# EAGLE design motherboard_r2 (EAGLE 8.1.1)
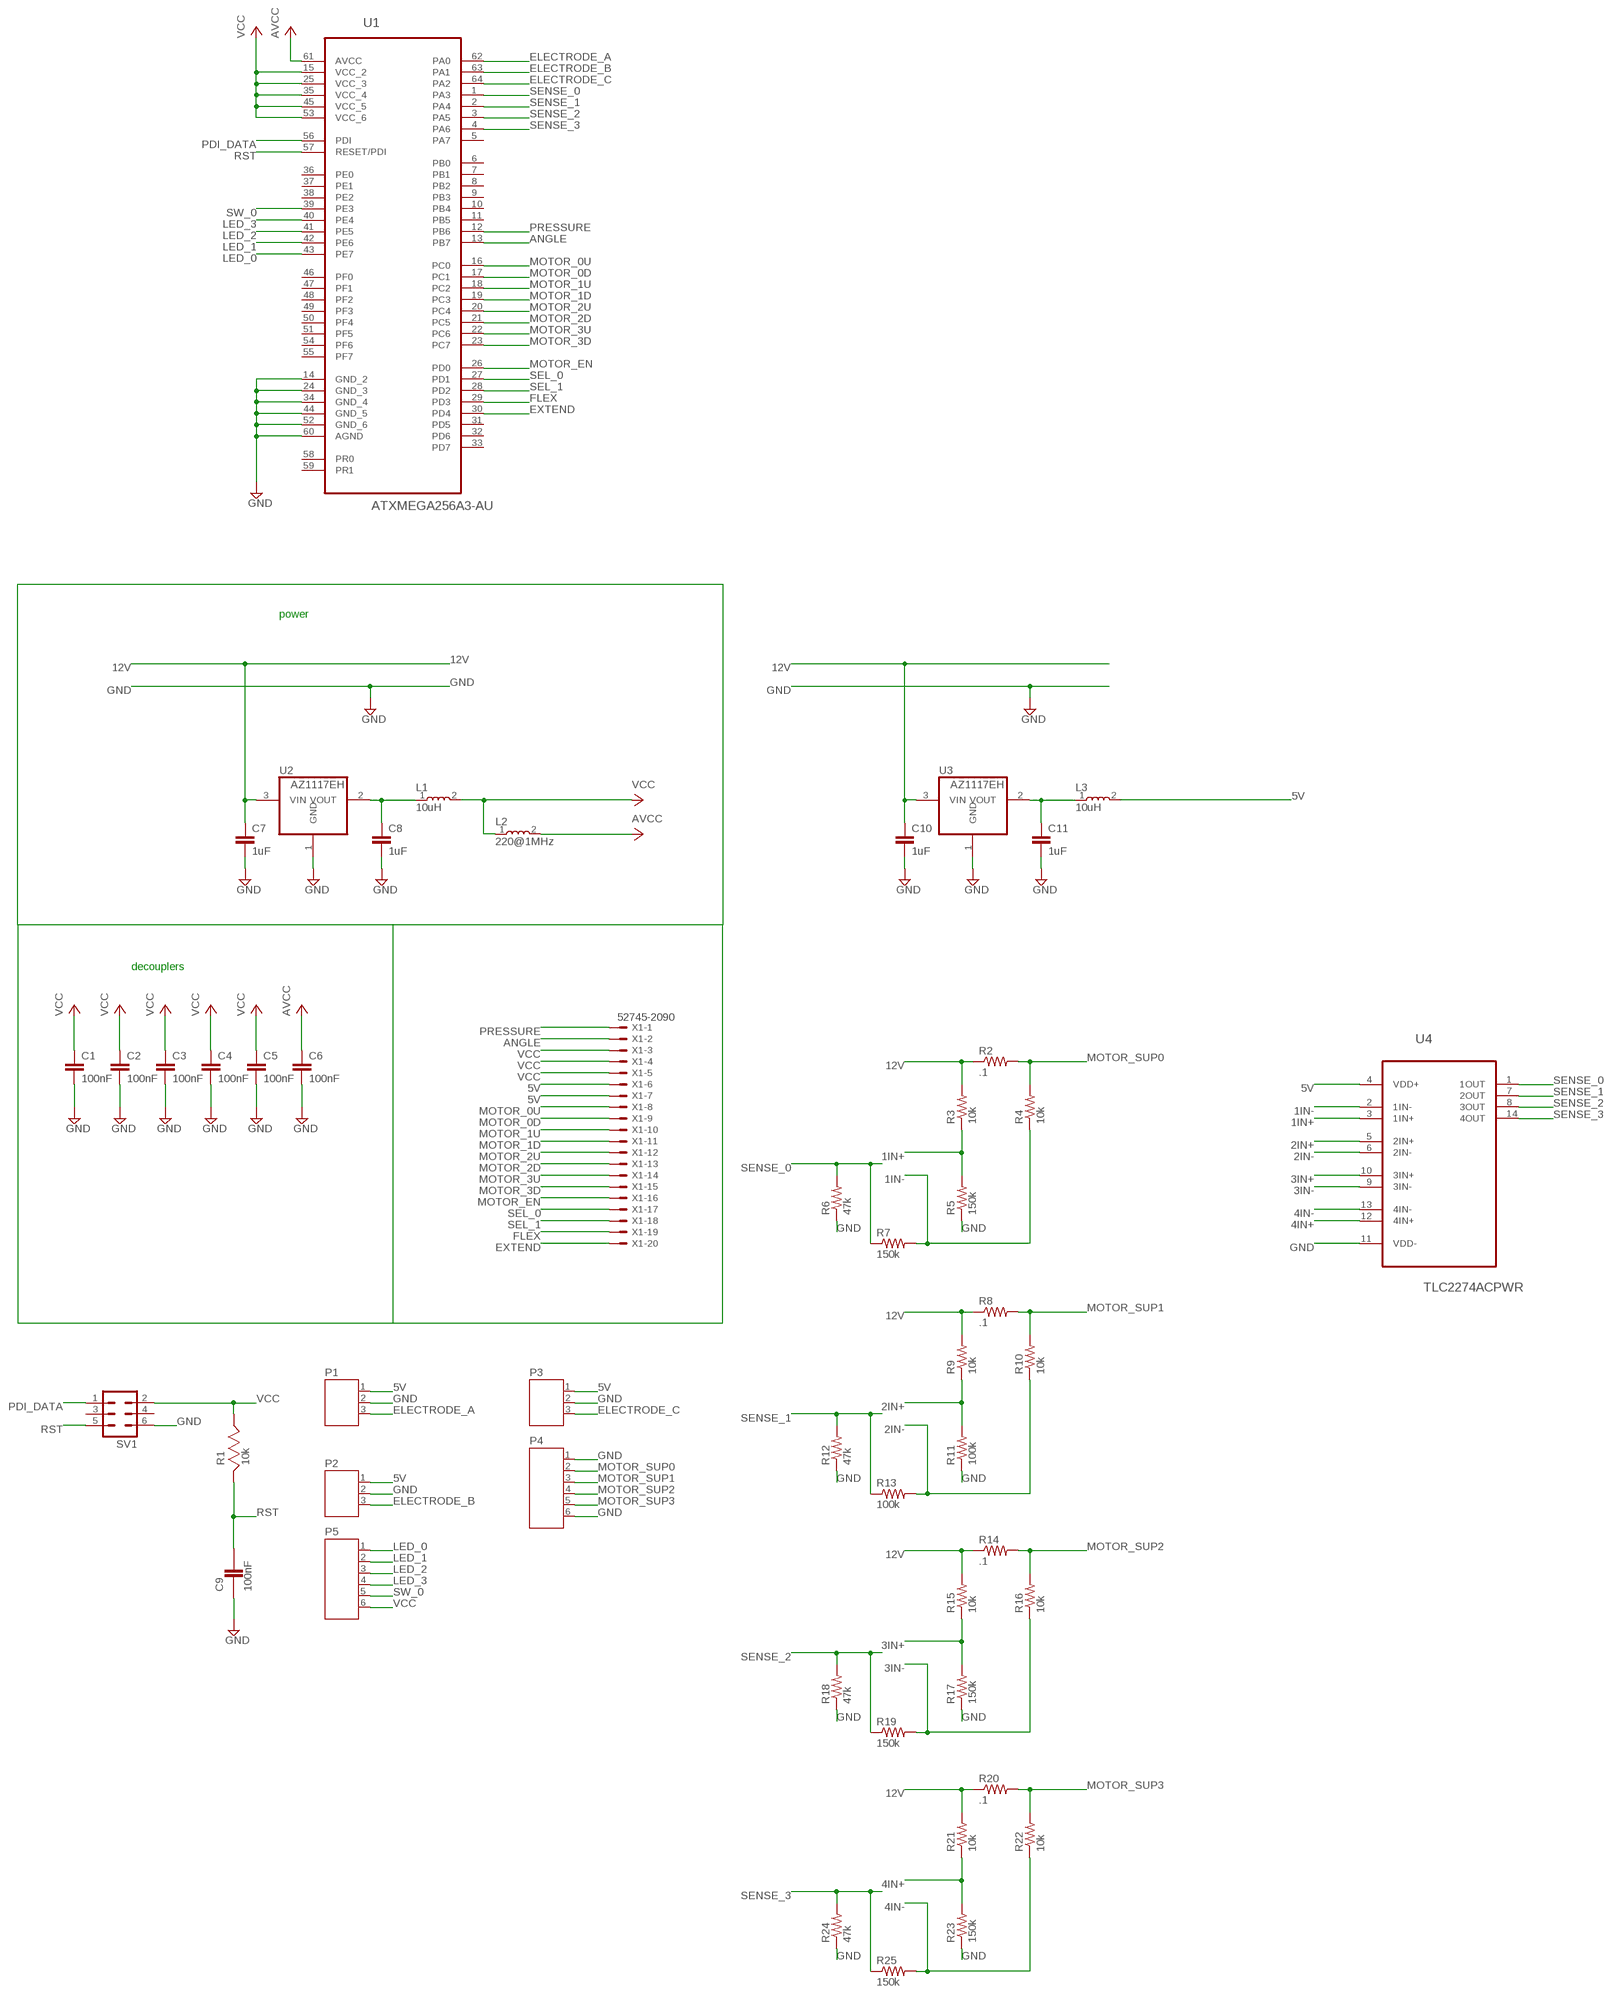
[diagram p0: schematic, sheet 1]

## Parts
C1  100nF  C-EUC0603  [C0603]
C2  100nF  C-EUC0603  [C0603]
C3  100nF  C-EUC0603  [C0603]
C4  100nF  C-EUC0603  [C0603]
C5  100nF  C-EUC0603  [C0603]
C6  100nF  C-EUC0603  [C0603]
C7  1uF  C-EUC0603  [C0603]
C8  1uF  C-EUC0603  [C0603]
C9  100nF  CC0603KRX7R8BB105  [CC0603KRX7R8BB105_CAPC1608X90]
C10  1uF  C-EUC0603  [C0603]
C11  1uF  C-EUC0603  [C0603]
L1  10uH  L0805  [0805]
L2  220@1MHz  L0805  [0805]
L3  10uH  L0805  [0805]
P1  JST-PH3  [JST-PH3]
P2  JST-PH3  [JST-PH3]
P3  JST-PH3  [JST-PH3]
P4  JST-PH6  [JST-PH6]
P5  JST-PH6  [JST-PH6]
R1  10k  CRCW060310K0FKEA  [CRCW060310K0FKEA_RESC1608X55]
R2  .1  R-US_R0603  [R0603]
R3  10k  R-US_R0603  [R0603]
R4  10k  R-US_R0603  [R0603]
R5  150k  R-US_R0603  [R0603]
R6  47k  R-US_R0603  [R0603]
R7  150k  R-US_R0603  [R0603]
R8  .1  R-US_R0603  [R0603]
R9  10k  R-US_R0603  [R0603]
R10  10k  R-US_R0603  [R0603]
R11  100k  R-US_R0603  [R0603]
R12  47k  R-US_R0603  [R0603]
R13  100k  R-US_R0603  [R0603]
R14  .1  R-US_R0603  [R0603]
R15  10k  R-US_R0603  [R0603]
R16  10k  R-US_R0603  [R0603]
R17  150k  R-US_R0603  [R0603]
R18  47k  R-US_R0603  [R0603]
R19  150k  R-US_R0603  [R0603]
R20  .1  R-US_R0603  [R0603]
R21  10k  R-US_R0603  [R0603]
R22  10k  R-US_R0603  [R0603]
R23  150k  R-US_R0603  [R0603]
R24  47k  R-US_R0603  [R0603]
R25  150k  R-US_R0603  [R0603]
SV1  MA03-2  [MA03-2]
U1  ATXMEGA256A3-AU  [QFP80P1600X1600X120-64N]
U2  AZ1117EH  [SOT230P700X160-4N]
U3  AZ1117EH  [SOT230P700X160-4N]
U4  TLC2274ACPWR  [SOP65P640X120-14N]
X1  52745-2090  [52745-2090]

## Nets
1IN+: R3.1 R5.2 U4.3(1IN+)
1IN-: R4.1 R7.2 U4.2(1IN-)
2IN+: R9.1 R11.2 U4.5(2IN+)
2IN-: R10.1 R13.2 U4.6(2IN-)
3IN+: R15.1 R17.2 U4.10(3IN+)
3IN-: R16.1 R19.2 U4.9(3IN-)
4IN+: R21.1 R23.2 U4.12(4IN+)
4IN-: R22.1 R25.2 U4.13(4IN-)
5V: L3.2 P1.1 P2.1 P3.1 U4.4(VDD+) X1.6 X1.7
12V: C7.1 C10.1 R2.1 R3.2 R8.1 R9.2 R14.1 R15.2 R20.1 R21.2 U2.3(VIN) U3.3(VIN)
ANGLE: U1.13(PB7) X1.2
AVCC: C6.1 L2.2 U1.61(AVCC)
ELECTRODE_A: P1.3 U1.62(PA0)
ELECTRODE_B: P2.3 U1.63(PA1)
ELECTRODE_C: P3.3 U1.64(PA2)
EXTEND: U1.30(PD4) X1.20
FLEX: U1.29(PD3) X1.19
GND: C1.2 C2.2 C3.2 C4.2 C5.2 C6.2 C7.2 C8.2 C9.1 C10.2 C11.2 P1.2 P2.2 P3.2 P4.1 P4.6 R5.1 R6.1 R11.1 R12.1 R17.1 R18.1 R23.1 R24.1 SV1.6 U1.14(GND_2) U1.24(GND_3) U1.34(GND_4) U1.44(GND_5) U1.52(GND_6) U1.60(AGND) U2.1(GND) U3.1(GND) U4.11(VDD-)
LED_0: P5.1 U1.43(PE7)
LED_1: P5.2 U1.42(PE6)
LED_2: P5.3 U1.41(PE5)
LED_3: P5.4 U1.40(PE4)
MOTOR_0D: U1.17(PC1) X1.9
MOTOR_0U: U1.16(PC0) X1.8
MOTOR_1D: U1.19(PC3) X1.11
MOTOR_1U: U1.18(PC2) X1.10
MOTOR_2D: U1.21(PC5) X1.13
MOTOR_2U: U1.20(PC4) X1.12
MOTOR_3D: U1.23(PC7) X1.15
MOTOR_3U: U1.22(PC6) X1.14
MOTOR_EN: U1.26(PD0) X1.16
MOTOR_SUP0: P4.2 R2.2 R4.2
MOTOR_SUP1: P4.3 R8.2 R10.2
MOTOR_SUP2: P4.4 R14.2 R16.2
MOTOR_SUP3: P4.5 R20.2 R22.2
N$1: C8.1 L1.1 U2.2(VOUT)
N$3: C11.1 L3.1 U3.2(VOUT)
PDI_DATA: SV1.1 U1.56(PDI)
PRESSURE: U1.12(PB6) X1.1
RST: C9.2 R1.1 SV1.5 U1.57(RESET/PDI)
SEL_0: U1.27(PD1) X1.17
SEL_1: U1.28(PD2) X1.18
SENSE_0: R6.2 R7.1 U1.1(PA3) U4.1(1OUT)
SENSE_1: R12.2 R13.1 U1.2(PA4) U4.7(2OUT)
SENSE_2: R18.2 R19.1 U1.3(PA5) U4.8(3OUT)
SENSE_3: R24.2 R25.1 U1.4(PA6) U4.14(4OUT)
SW_0: P5.5 U1.39(PE3)
VCC: C1.1 C2.1 C3.1 C4.1 C5.1 L1.2 L2.1 P5.6 R1.2 SV1.2 U1.15(VCC_2) U1.25(VCC_3) U1.35(VCC_4) U1.45(VCC_5) U1.53(VCC_6) X1.3 X1.4 X1.5
Unconnected: SV1.3 SV1.4 U1.5(PA7) U1.6(PB0) U1.7(PB1) U1.8(PB2) U1.9(PB3) U1.10(PB4) U1.11(PB5) U1.31(PD5) U1.32(PD6) U1.33(PD7) U1.36(PE0) U1.37(PE1) U1.38(PE2) U1.46(PF0) U1.47(PF1) U1.48(PF2) U1.49(PF3) U1.50(PF4) U1.51(PF5) U1.54(PF6) U1.55(PF7) U1.58(PR0) U1.59(PR1)

## Notes on the sheet
- power
- decouplers

## Library data of the parts
C1-C8 C10 C11 = rcl:C-EU: CAPACITOR, European symbol
C9 = Common-Parts-Library-Eagle:CC0603KRX7R8BB105: Cap Ceramic 1uF 25V X7R 10% SMD 0603 125C Paper T/R; MANUFACTURER: YAGEO
L1-L3 = hands:L0805
P1-P3 = jst-ph:JST-PH3
P4 P5 = jst-ph:JST-PH6
R1 = Common-Parts-Library-Eagle:CRCW060310K0FKEA: Res Thick Film 0603 10K Ohm 1% 0.1W(1/10W) ?100ppm/C Molded SMD Automotive Paper T/R; MANUFACTURER: VISHAY
R2-R25 = rcl:R-US_: RESISTOR, American symbol
SV1 = con-lstb:MA03-2: PIN HEADER; OC_FARNELL: unknown; OC_NEWARK: unknown
U1 = ATXMEGA256A3-AU:ATXMEGA256A3-AU: MCU; AVAILABILITY: Good; DESCRIPTION: XMEGA Series 32 MHz 256 KB Flash 16 KB SRAM 8/16-Bit Microcontroller - TQFP-64; MF: Atmel; MP: ATXMEGA256A3-AU; PACKAGE: TQFP-64 Atmel; PRICE: 8.74 USD
U2 U3 = hands:AZ1117EH
U4 = TLC2274ACPWR:TLC2274ACPWR: OPERATIONAL AMPLIFIERS; AVAILABILITY: Good; DESCRIPTION: Advanced LinCMOS%28TM%29 Rail-To-Rail Quad Operational Amplifier 14-TSSOP 0 to 70; MF: Texas Instruments; MP: TLC2274ACPWR; PACKAGE: TSSOP-14 Texas Instruments; PRICE: 1.29 USD
X1 = con-molex:52745-2090: FFC/FPC-to-Board 0.50mm (.020") SMT Top Contact Right Angle, ZIF, Style Receptacle 52745 / 52435 Source: http://www.molex.com/product/ffc/52745.html; MF: WALDOM/MOLEX; MPN: 52745-2090; OC_FARNELL: unknown; OC_NEWARK: 38C9891

## Board
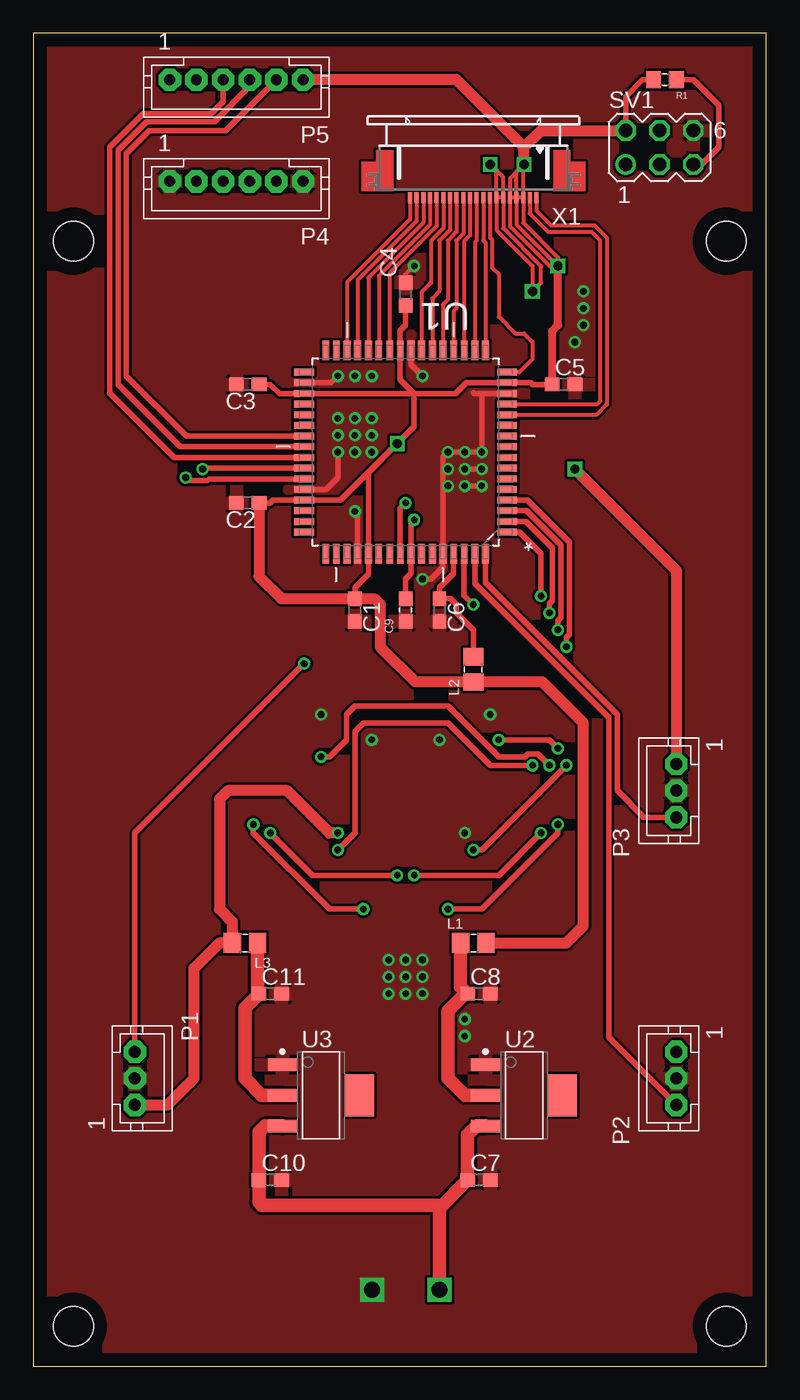
[diagram p1: board, top side]
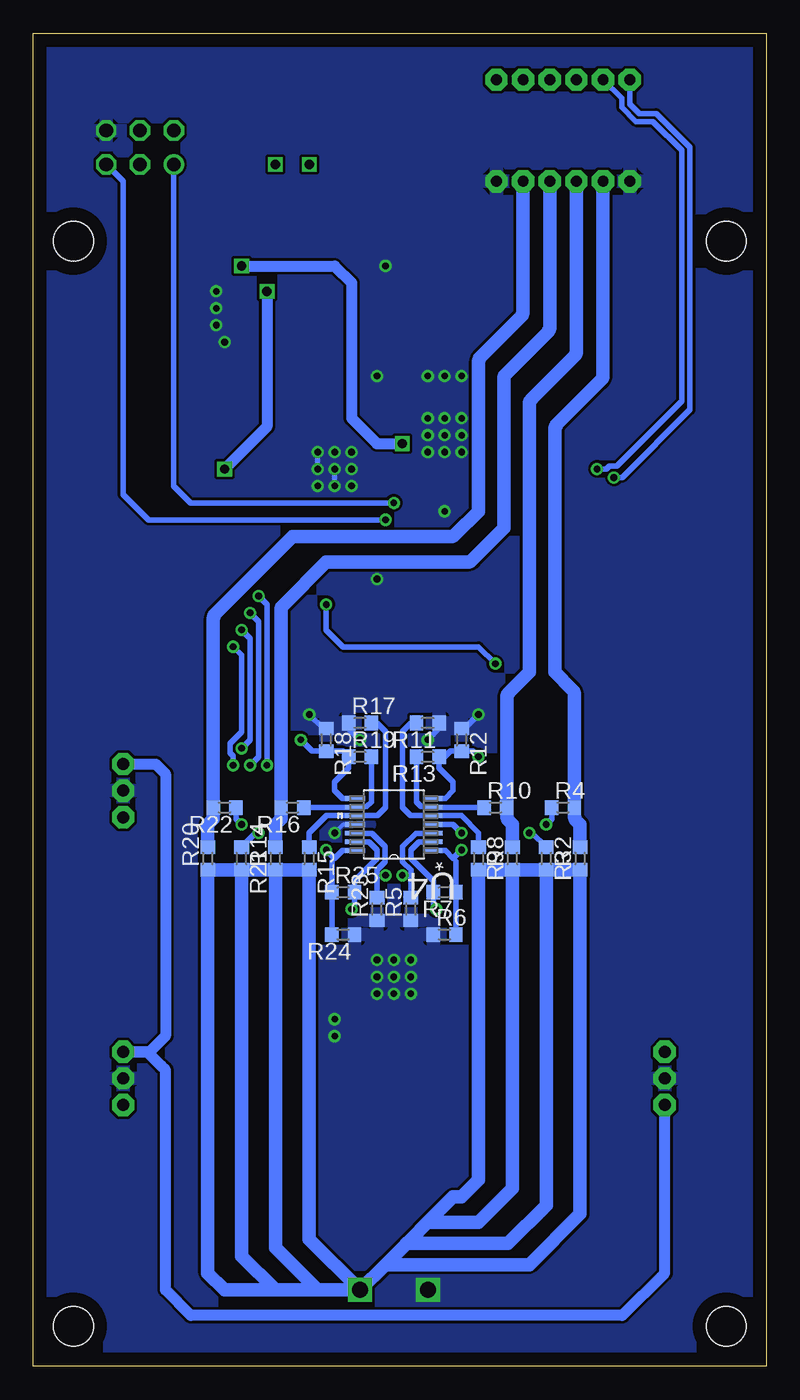
[diagram p2: board, bottom side, seen from below]

Size 55 x 100 mm. Coordinates in mm from the lower left corner, seen from the top.
Outline: 0,0 55,0 55,100 0,100 0,0
Copper layers (1*16): Top 0.035mm / dielectric 1.5mm / Bottom 0.035mm
Design rules "default": minimum track width 10mil, minimum drill 24mil, track to track 8mil, track to pad 8mil, pad to pad 8mil, via to via 8mil, smd to smd 8mil, copper to edge 40mil, drill to drill 8mil, minimum pad ring 10mil, minimum via ring 8mil, stop-mask expansion 4mil, vias tented up to drill 0mil, thermal gap 10mil
Holes 3 mm at 3,3 52,3 3,84.4 52,84.4

### Footprints (pad centres in the part's own frame; a part is rotated, then mirrored left to right if it is on the bottom)
C0603 = smd 1.1 x 1: 1 -0.85,0; 2 0.85,0
CC0603KRX7R8BB105_CAPC1608X90 = smd 1.1 x 1: 1 -0.85,0; 2 0.85,0
0805 = smd 1.3 x 1.5: 1 -0.95,0; 2 0.95,0
JST-PH3 = drill 0.9 pad 1.676 octagon: 1 2,0; 2 0,0; 3 -2,0
JST-PH6 = drill 0.813 pad 1.676 octagon: 1 5,0; 2 3,0; 3 1,0; 4 -1,0; 5 -3,0; 6 -5,0
CRCW060310K0FKEA_RESC1608X55 = smd 1.1 x 1.25: 1 -0.85,0; 2 0.85,0
R0603 = smd 1 x 1.1: 1 -0.85,0; 2 0.85,0
MA03-2 = drill 1.016: 1 -2.54,-1.27 | drill 1.016 octagon: 2 -2.54,1.27; 3 0,-1.27; 4 0,1.27; 5 2.54,-1.27; 6 2.54,1.27
QFP80P1600X1600X120-64N = smd 1.473 x 0.508: 1 -7.62,5.994; 2 -7.62,5.207; 3 -7.62,4.394; 4 -7.62,3.607; 5 -7.62,2.794; 6 -7.62,2.007; 7 -7.62,1.194; 8 -7.62,0.406; 9 -7.62,-0.406; 10 -7.62,-1.194; 11 -7.62,-2.007; 12 -7.62,-2.794; 13 -7.62,-3.607; 14 -7.62,-4.394; 15 -7.62,-5.207; 16 -7.62,-5.994; 33 7.62,-5.994; 34 7.62,-5.207; 35 7.62,-4.394; 36 7.62,-3.607; 37 7.62,-2.794; 38 7.62,-2.007; 39 7.62,-1.194; 40 7.62,-0.406; 41 7.62,0.406; 42 7.62,1.194; 43 7.62,2.007; 44 7.62,2.794; 45 7.62,3.607; 46 7.62,4.394; 47 7.62,5.207; 48 7.62,5.994 | smd 0.508 x 1.473: 17 -5.994,-7.62; 18 -5.207,-7.62; 19 -4.394,-7.62; 20 -3.607,-7.62; 21 -2.794,-7.62; 22 -2.007,-7.62; 23 -1.194,-7.62; 24 -0.406,-7.62; 25 0.406,-7.62; 26 1.194,-7.62; 27 2.007,-7.62; 28 2.794,-7.62; 29 3.607,-7.62; 30 4.394,-7.62; 31 5.207,-7.62; 32 5.994,-7.62; 49 5.994,7.62; 50 5.207,7.62; 51 4.394,7.62; 52 3.607,7.62; 53 2.794,7.62; 54 2.007,7.62; 55 1.194,7.62; 56 0.406,7.62; 57 -0.406,7.62; 58 -1.194,7.62; 59 -2.007,7.62; 60 -2.794,7.62; 61 -3.607,7.62; 62 -4.394,7.62; 63 -5.207,7.62; 64 -5.994,7.62
SOT230P700X160-4N = smd 2.15 x 0.95: 1 -2.9,2.3; 2 -2.9,0; 3 -2.9,-2.3 | smd 2.15 x 3.15: 4 2.9,0
SOP65P640X120-14N = smd 1.473 x 0.356: 1 -2.921,1.956; 2 -2.921,1.295; 3 -2.921,0.66; 4 -2.921,0; 5 -2.921,-0.66; 6 -2.921,-1.295; 7 -2.921,-1.956; 8 2.921,-1.956; 9 2.921,-1.295; 10 2.921,-0.66; 11 2.921,0; 12 2.921,0.66; 13 2.921,1.295; 14 2.921,1.956
52745-2090 = smd 0.3 x 0.8: 1 -4.75,2.5; 2 -4.25,2.5; 3 -3.75,2.5; 4 -3.25,2.5; 5 -2.75,2.5; 6 -2.25,2.5; 7 -1.75,2.5; 8 -1.25,2.5; 9 -0.75,2.5; 10 -0.25,2.5; 11 0.25,2.5; 12 0.75,2.5; 13 1.25,2.5; 14 1.75,2.5; 15 2.25,2.5; 16 2.75,2.5; 17 3.25,2.5; 18 3.75,2.5; 19 4.25,2.5; 20 4.75,2.5

### Placement (x,y rotation side)
C1  24.13,56.73 270 top
C2  16.09,64.77 180 top
C3  16.09,73.66 180 top
C4  27.94,80.43 90 top
C5  39.79,73.66 0 top
C6  30.48,56.73 270 top
C7  33.44,13.97 0 top
C8  33.44,27.94 0 top
C9  27.94,56.73 90 top
C10  17.78,13.97 0 top
C11  17.78,27.94 0 top
L1  33.02,31.75 0 top
L2  33.02,52.28 90 top
L3  15.88,31.75 180 top
P1  7.62,21.59 270 top
P2  48.26,21.59 90 top
P3  48.26,43.18 90 top
P4  15.24,88.9 180 top
P5  15.24,96.52 180 top
R1  47.41,96.52 180 top
R2  13.97,38.1 90 bottom
R3  16.51,38.1 270 bottom
R4  15.24,41.91 0 bottom
R5  26.67,34.29 90 bottom
R6  24.13,32.38 0 bottom
R7  24.13,35.56 180 bottom
R8  19.05,38.1 90 bottom
R9  21.59,38.1 270 bottom
R10  20.32,41.91 0 bottom
R11  25.4,48.26 180 bottom
R12  22.86,46.99 270 bottom
R13  25.4,45.72 180 bottom
R14  36.83,38.1 90 bottom
R15  34.29,38.1 270 bottom
R16  35.56,41.91 180 bottom
R17  30.48,48.26 0 bottom
R18  33.02,46.99 270 bottom
R19  30.48,45.72 0 bottom
R20  41.91,38.1 90 bottom
R21  39.37,38.1 270 bottom
R22  40.64,41.91 180 bottom
R23  29.21,34.29 90 bottom
R24  31.75,32.38 180 bottom
R25  31.75,35.56 0 bottom
SV1  46.99,91.44 0 top
U1  27.94,68.58 180 top
U2  36.83,20.32 0 top
U3  21.59,20.32 0 top
U4  27.94,40.64 180 bottom
X1  33.02,90.17 180 top

### Tracks (layer width: path | path; a pad name or v marks a point on that pad's centre or on a via)
1IN+  (via drill 0.5)
  Top 0.406: v17.78,40.01 20.95,36.83 v27.3,36.83
  Bottom 0.406: 26.67,36.83 26.67,37.24 27.28,37.85 27.28,38.99 26.29,39.98 U4.3 | 26.67,36.83 R5.2 | R3.1 17.57,40.01 v17.78,40.01 | v27.3,36.83 26.67,36.83
1IN-  (via drill 0.5)
  Top 0.406: v16.51,40.64 16.51,40.01 22.23,34.29 v24.77,34.29
  Bottom 0.406: U4.2 26.06,39.34 26.67,38.73 26.67,38.1 24.98,36.41 R7.2 24.98,34.51 v24.77,34.29 | R4.1 16.09,41.06 v16.51,40.64
2IN+
  Bottom 0.406: R9.1 21.59,40.01 22.89,41.3 U4.5 26.7,41.3 27.3,41.91 27.3,47.62 26.67,48.26 R11.2
2IN-
  Bottom 0.406: R10.1 21.17,41.94 U4.6 25.07,41.99 25.9,41.99 26.25,42.34 R13.2
3IN+
  Bottom 0.406: R15.1 34.29,40.01 32.99,41.3 U4.10 29.18,41.3 28.57,41.91 28.57,47.62 29.21,48.26 R17.2
3IN-
  Bottom 0.406: R19.2 29.63,42.34 29.98,41.99 30.81,41.99 U4.9 30.89,41.91 R16.1
4IN+  (via drill 0.5)
  Top 0.406: v38.1,40.01 34.92,36.83 v28.57,36.83
  Bottom 0.406: 29.21,36.83 R23.2 | 29.21,36.83 29.21,37.24 28.6,37.85 28.6,38.99 29.59,39.98 U4.12 | R21.1 38.31,40.01 v38.1,40.01 | v28.57,36.83 29.21,36.83
4IN-  (via drill 0.5)
  Top 0.406: v39.37,40.64 39.37,40.01 33.66,34.29 v31.11,34.29
  Bottom 0.406: U4.13 29.82,39.34 29.21,38.73 29.21,38.1 30.9,36.41 R25.2 30.9,34.51 v31.11,34.29 | R22.1 39.79,41.06 v39.37,40.64
5V  (via drill 0.5, 0.7)
  Top 0.305: X1.6 X1.7 | X1.7 34.77,89.69 v34.29,90.17 35.27,89.19 X1.6 | X1.6 35.27,85.38 38.1,82.55 | X1.7 34.77,85.25 37.47,82.55 v37.47,80.64 38.1,81.28 38.1,82.47
  Top 0.813: P1.1 10.06,19.59 12.06,21.59 12.06,29.84 13.97,31.75 L3.2 14.93,33.34 13.97,34.29 13.97,42.55 14.61,43.18 19.05,43.18 22.23,40.01 v22.86,40.01 | v40.64,67.31 48.26,59.69 P3.1
  Bottom 0.406: U4.4 23.5,40.64 v22.86,40.01
  Bottom 0.813: P3.1 45.81,45.18 45.09,44.45 45.09,24.77 46.26,23.59 P2.1 46.45,23.59 45.4,22.54 | 45.4,22.54 45.09,22.23 | P1.1 7.62,6.99 10.79,3.81 43.18,3.81 45.09,5.71 45.09,22.23 | 45.09,22.23 45.4,22.54 | v37.47,80.64 37.47,70.48 v40.64,67.31
12V  (via drill 1.2)
  Top 1.016: U3.3 17.39,18.02 16.93,17.57 C10.1 16.93,12.28 17.14,12.06 30.27,12.06 30.48,11.86 | U2.3 33.26,18.02 32.59,17.35 C7.1 30.48,11.86 | 30.48,11.86 v30.48,5.71
  Bottom 0.305: 39.37,36.2 R21.2
  Bottom 1.016: R3.2 R2.1 | R8.1 R3.2 | R8.1 R9.2 21.59,13.97 22.86,12.7 23.5,12.7 28.57,7.62 | R14.1 R21.2 R20.1 41.91,6.99 40.64,5.71 v30.48,5.71 | R14.1 R15.2 | 36.83,5.71 39.37,8.26 39.37,36.2 39.37,36.83 | 33.66,5.71 36.83,8.89 36.83,35.56 | v30.48,5.71 34.29,9.53 34.29,36.83 | 28.57,7.62 v30.48,5.71 | 25.4,10.79 21.59,10.79 19.05,13.34 R8.1 | 26.99,9.21 19.37,9.21 16.51,12.06 R3.2 | 13.97,36.83 13.97,11.43 17.78,7.62 28.57,7.62 | 36.83,35.56 36.83,36.83 | R14.1 36.83,35.56
ANGLE
  Top 0.305: U1.13 42.34,72.19 42.55,72.39 42.55,84.45 41.91,85.09 38.65,85.09 37.26,86.48 37.26,87.11 37.27,87.12 X1.2
AVCC
  Top 0.406: U1.61 31.55,59.49 30.48,58.42 C6.1 31.32,57.58 31.75,57.15 31.75,56.52 33.02,55.24 L2.2
ELECTRODE_A  (via drill 0.5)
  Top 0.406: U1.62 32.33,57.84 v33.02,57.15 | v20.32,52.7 7.62,40.01 P1.3
  Bottom 0.406: v33.02,57.15 33.02,55.24 31.75,53.98 21.59,53.98 v20.32,52.7
ELECTRODE_B
  Top 0.406: P2.3 43.18,24.67 43.18,48.67 33.15,58.7 U1.63
ELECTRODE_C
  Top 0.406: U1.64 33.93,58.78 43.81,48.9 43.81,43.18 45.81,41.18 P3.3
EXTEND
  Top 0.305: X1.20 28.27,86.06 23.55,81.33 U1.30
FLEX
  Top 0.305: X1.19 28.77,85.92 24.33,81.48 U1.29
GND  (via drill 0.5, 1.2)
  Top 0.305: C4.2 27.94,81.92 v28.57,82.55
  Top 0.406: v33.66,67.31 v32.38,67.31 | v32.38,66.04 v33.66,66.04 | 33.66,72.97 U1.14 | 33.66,72.97 33.07,72.97 33.02,73.03 | 33.66,72.97 v33.66,68.58 v32.38,68.58 v31.11,68.58 30.73,68.2 U1.60 30.73,59.94 29.84,59.05 v29.21,59.05 | U1.44 21.97,65.79 22.86,66.67 v22.86,68.58 | U1.34 22.35,73.79 v22.86,74.3 | U1.24 28.35,75.16 v29.21,74.3 | U1.52 24.33,63.93 v24.13,64.14
  Bottom 0.305: U4.11 31.75,40.64 v32.38,40.01
  Bottom 0.406: R17.1 31.33,47.84 v30.48,46.99 | R18.1 33.23,47.84 v34.29,48.9 | R11.1 24.55,47.84 v25.4,46.99 | R12.1 22.64,47.84 v21.59,48.9 | v33.66,68.58 v33.66,67.31 | v32.38,67.31 v32.38,66.04
  other vias: 29.21,27.94 29.21,29.21 29.21,30.48 27.94,30.48 27.94,29.21 27.94,27.94 26.67,27.94 26.67,29.21 26.67,30.48 31.11,67.31 31.11,66.04 41.27,80.64 41.27,79.38 41.27,78.11 40.64,76.83 24.13,68.58 25.4,68.58 25.4,69.85 24.13,69.85 22.86,69.85 22.86,71.12 24.13,71.12 25.4,71.12 24.13,74.3 25.4,74.3 32.38,24.77 32.38,26.04 25.4,5.71
  pour Bottom: -7.62,108.58 60.33,108.58 60.96,107.95 60.96,-12.06 -6.99,-12.06 -7.62,-11.43
  pour Top: -10.16,111.12 65.41,111.12 66.04,110.49 66.04,-17.78 -9.53,-17.78 -10.16,-17.14
LED_0  (via drill 0.5)
  Top 0.406: U1.43 13.18,66.57 13.06,66.45 11.65,66.45 v11.43,66.67
  Bottom 0.406: P5.1 10.24,94.69 9.53,93.98 8.26,93.98 5.71,91.44 5.71,85.53 5.72,85.53 5.72,71.75 10.79,66.67 v11.43,66.67
LED_1  (via drill 0.5)
  Top 0.406: v12.7,67.31 12.78,67.39 U1.42
  Bottom 0.406: P5.2 10.85,95.13 10.85,94.44 9.78,93.37 8.51,93.37 6.35,91.21 6.35,72.39 11.21,67.53 11.79,67.53 12.01,67.31 v12.7,67.31
LED_2
  Top 0.406: P5.3 14.24,94.89 13.34,93.98 8.26,93.98 5.72,91.44 5.72,73.02 10.57,68.17 U1.41
LED_3
  Top 0.406: 13.59,93.37 13.34,93.37 | 13.34,93.37 8.51,93.37 6.35,91.21 6.35,73.66 11.02,68.99 U1.40 | 13.34,93.37 13.59,93.37 | 13.59,93.37 16.24,96.02 P5.4
MOTOR_0D
  Top 0.305: X1.9 33.77,84.45 33.93,84.29 U1.17
MOTOR_0U
  Top 0.305: X1.8 34.27,85.11 34.28,85.11 34.28,84.67 34.44,84.5 34.44,82.4 34.92,81.92 34.92,78.74 36.2,77.47 36.83,77.47 37.47,76.83 37.47,75.56 36.47,74.57 U1.16
MOTOR_1D
  Top 0.305: X1.11 32.77,84.84 32.33,84.4 U1.19
MOTOR_1U
  Top 0.305: X1.10 33.27,84.45 33.15,84.33 U1.18
MOTOR_2D
  Top 0.305: X1.13 31.77,85.11 31.11,84.45 31.11,80.01 30.73,79.63 U1.21
MOTOR_2U
  Top 0.305: X1.12 32.27,84.97 31.75,84.45 31.75,79.38 31.55,79.17 U1.20
MOTOR_3D
  Top 0.305: X1.15 30.77,85.38 29.84,84.45 29.84,81.28 29.13,80.57 U1.23
MOTOR_3U
  Top 0.305: X1.14 31.27,85.25 30.48,84.45 30.48,80.64 29.95,80.11 U1.22
MOTOR_EN
  Top 0.305: X1.16 30.27,85.52 26.75,81.99 U1.26
MOTOR_SUP0
  Bottom 1.016: P4.2 12.24,74.38 arc45 12.43,73.93 15.69,70.67 arc-45 15.88,70.22 15.88,52.07 14.58,50.77 arc45 14.39,50.32 R4.2 14.39,41.32 arc-45 14.2,40.87 13.97,40.64 R2.2
MOTOR_SUP1
  Bottom 1.016: R8.2 19.05,40.64 19.28,40.87 arc45 19.47,41.32 R10.2 19.47,50.12 arc45 19.28,50.57 17.78,52.07 17.78,72.13 arc45 17.59,72.58 14.43,75.74 arc-45 14.24,76.19 P4.3
MOTOR_SUP2
  Bottom 1.016: P4.4 16.24,78 arc45 16.43,77.55 19.5,74.48 arc-45 19.68,74.03 19.68,62.87 22.04,60.51 arc45 22.49,60.33 33.02,60.33 36.22,57.12 arc-45 36.41,56.67 R16.2 36.41,41.06 36.83,40.64 R14.2
MOTOR_SUP3
  Bottom 1.016: P4.5 18.24,79.16 arc45 18.41,78.74 21.4,75.75 arc-45 21.59,75.3 21.59,64.14 23.31,62.42 arc45 23.76,62.23 35.56,62.23 41.3,56.49 arc-45 41.49,56.04 R22.2 41.49,41.06 41.91,40.64 R20.2
N$1
  Top 1.016: U2.2 32.38,20.32 31.11,21.59 31.11,26.67 32.38,27.94 C8.1 32.07,28.46 L1.1
N$3
  Top 1.016: U3.2 17.14,20.32 15.88,21.59 15.88,26.89 C11.1 16.83,28.04 L3.1
PDI_DATA  (via drill 0.5)
  Top 0.406: U1.56 27.53,64.36 v27.94,64.77
  Bottom 0.406: v27.94,64.77 43.18,64.77 44.45,66.04 SV1.1
PRESSURE
  Top 0.305: X1.1 37.77,86.69 38.86,85.6 42.12,85.6 43.05,84.67 43.05,72.18 42.25,71.37 U1.12
RST  (via drill 0.5)
  Top 0.406: C9.2 27.94,59.05 28.35,59.46 U1.57 28.35,63.27 v28.57,63.5 | R1.1 49.53,96.52 51.44,94.61 51.44,91.44 50.16,90.17 SV1.5
  Bottom 0.406: v28.57,63.5 46.35,63.5 48.26,65.41 48.26,88.9 SV1.5
SEL_0
  Top 0.305: X1.17 29.77,85.65 25.93,81.81 U1.27
SEL_1
  Top 0.305: X1.18 29.27,85.78 25.15,81.66 U1.28
SENSE_0  (via drill 0.5)
  Top 0.406: v22.86,38.73 24.13,40.01 24.13,47.62 24.77,48.26 31.11,48.26 34.29,45.09 v37.47,45.09 | v38.1,57.78 38.1,60.96 36.47,62.59 U1.1
  Bottom 0.305: 23.28,37.88 23.5,38.1
  Bottom 0.406: U4.1 24.08,38.68 23.5,38.1 v22.86,38.73 | 23.28,37.88 R7.1 R6.2 | v37.47,45.09 37.47,57.15 v38.1,57.78
SENSE_1  (via drill 0.5)
  Top 0.406: v38.73,45.09 37.88,45.95 37.11,45.95 36.88,45.72 34.92,45.72 31.11,49.53 24.13,49.53 23.5,48.9 23.5,46.99 22.23,45.72 v21.59,45.72 | v38.73,56.52 38.73,57.2 38.96,57.43 38.96,61.37 36.96,63.37 U1.2
  Bottom 0.406: U4.7 24.08,42.6 23.5,43.18 23.5,43.81 24.55,44.87 R13.1 24.13,45.72 23.71,46.14 R12.2 22.01,46.14 v21.59,45.72 | v38.73,45.09 38.1,45.72 38.1,55.88 v38.73,56.52
SENSE_2  (via drill 0.5)
  Top 0.406: v34.92,46.99 38.73,46.99 v39.37,46.35 | v39.37,55.24 39.37,55.93 39.59,56.16 39.59,61.6 37.01,64.19 U1.3
  Bottom 0.406: U4.8 31.8,42.6 32.38,43.18 32.38,43.81 31.33,44.87 R19.1 31.75,46.14 R18.2 34.08,46.14 v34.92,46.99 | v39.37,46.35 38.73,46.99 38.73,54.61 v39.37,55.24
SENSE_3  (via drill 0.5)
  Top 0.406: v33.02,38.73 33.66,38.73 v40.01,45.09 | v40.01,53.98 40.01,54.66 40.23,54.89 40.23,61.83 37.08,64.97 U1.4
  Bottom 0.305: 32.6,37.88 32.38,38.1
  Bottom 0.406: U4.14 31.8,38.68 32.38,38.1 v33.02,38.73 | 32.6,37.88 R25.1 R24.2 | v40.01,45.09 40.01,45.77 40.23,46 40.23,46.71 39.37,47.57 39.37,53.34 v40.01,53.98
SW_0
  Top 0.406: P5.5 14.43,92.71 8.71,92.71 6.99,90.99 6.99,74.3 11.51,69.77 U1.39
VCC  (via drill 0.7)
  Top 0.305: X1.3 X1.4 | X1.4 36.27,89.61 v36.83,90.17 | v36.83,90.17 35.77,89.11 X1.5 35.77,85.52 39.37,81.92 v39.37,82.55 | X1.3 36.77,90.11 v36.83,90.17 | X1.4 X1.5 | X1.3 36.77,85.78 39.37,83.19 v39.37,82.55 | X1.4 36.27,85.65 v39.37,82.55
  Top 0.406: C2.1 17.78,64.77 17.98,64.97 U1.45 23.06,64.97 v27.3,69.22 | C3.1 17.78,73.66 18.47,72.97 U1.35 28.57,72.97 | C4.1 27.94,78.11 27.53,77.7 U1.25 27.53,74.02 28.57,72.97 | C5.1 37.47,73.66 37.34,73.79 U1.15 32.51,73.79 31.7,72.97 28.57,72.97 | C1.1 24.13,58.42 25.15,59.44 U1.53 25.15,67.06 v27.3,69.22 | SV1.2 44.45,95.25 45.72,96.52 R1.2 | v27.3,69.22 28.57,70.48 28.57,72.97
  Top 0.61: C5.1 38.94,77.67 39.37,78.11 v39.37,82.55
  Top 0.813: SV1.2 38.1,92.71 36.83,91.44 | v36.83,90.17 36.83,91.44 | P5.6 31.75,96.52 36.83,91.44 | C2.1 16.94,59.26 18.62,57.58 C1.1 25.61,57.58 26.04,57.15 26.04,53.98 28.68,51.34 L2.1 38.2,51.34 41.27,48.26 41.27,33.02 40.01,31.75 L1.2
  Bottom 0.813: v39.37,82.55 32.38,82.55 31.11,81.28 31.11,71.12 29.21,69.22 v27.3,69.22